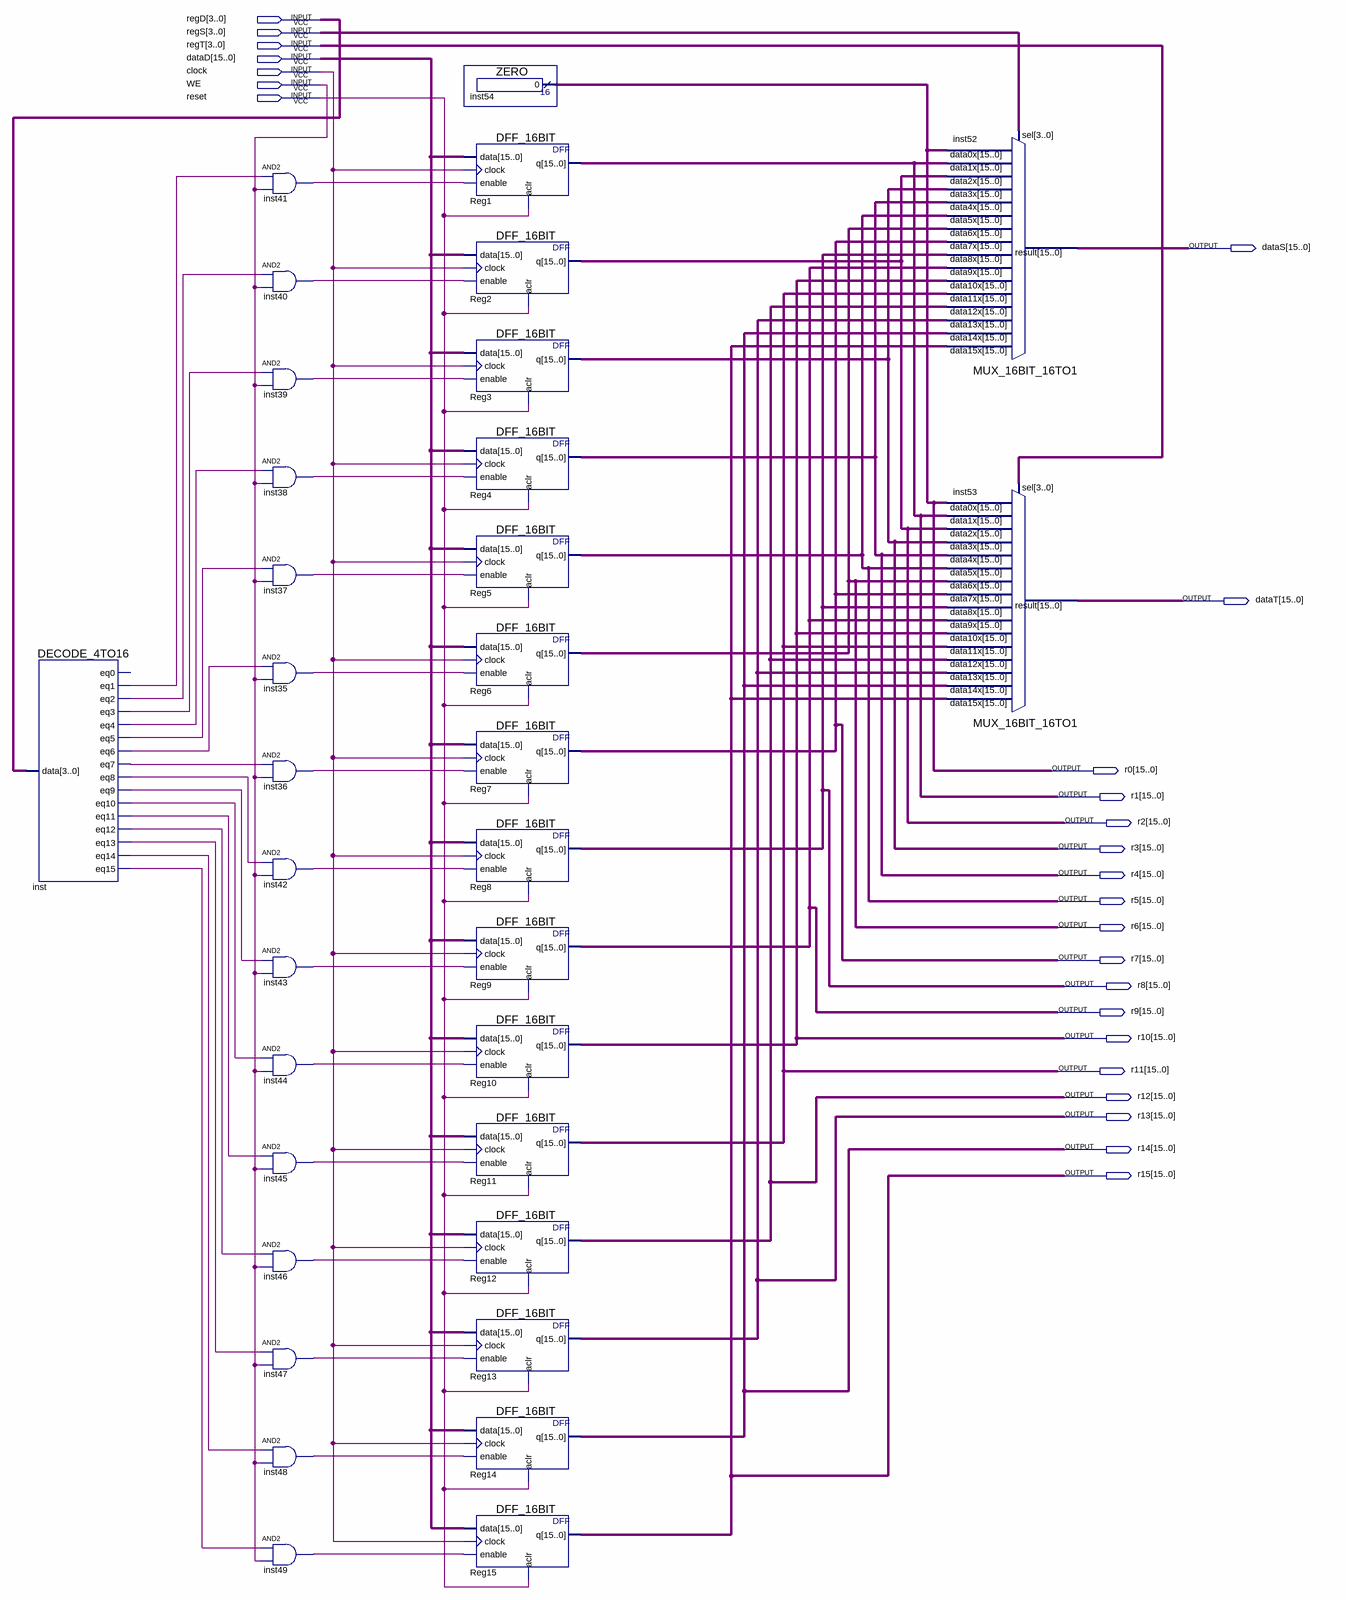
[diagram p0: schematic sheet]
// Quartus schematic regfile.bdf as structural Verilog: 34 symbols, 25 pins
module regfile (
  input  [3:0] regD,
  input  [3:0] regS,
  input  [3:0] regT,
  input  [15:0] dataD,
  input  clock,
  input  WE,
  input  reset,
  output [15:0] dataS,
  output [15:0] dataT,
  output [15:0] r0,
  output [15:0] r1,
  output [15:0] r2,
  output [15:0] r3,
  output [15:0] r4,
  output [15:0] r5,
  output [15:0] r6,
  output [15:0] r7,
  output [15:0] r8,
  output [15:0] r9,
  output [15:0] r10,
  output [15:0] r11,
  output [15:0] r12,
  output [15:0] r13,
  output [15:0] r14,
  output [15:0] r15
);

  wire inst35_out, inst36_out, inst37_out, inst38_out, inst39_out, inst40_out, inst41_out, inst42_out,
       inst43_out, inst44_out, inst45_out, inst46_out, inst47_out, inst48_out, inst49_out, inst_eq1,
       inst_eq2, inst_eq3, inst_eq4, inst_eq5, inst_eq6, inst_eq7, inst_eq8, inst_eq9, inst_eq10, inst_eq11,
       inst_eq12, inst_eq13, inst_eq14, inst_eq15;

  DECODE_4TO16 inst (
    .data(regD), .eq1(inst_eq1), .eq2(inst_eq2), .eq3(inst_eq3), .eq4(inst_eq4), .eq5(inst_eq5),
    .eq6(inst_eq6), .eq7(inst_eq7), .eq8(inst_eq8), .eq9(inst_eq9), .eq10(inst_eq10), .eq11(inst_eq11),
    .eq12(inst_eq12), .eq13(inst_eq13), .eq14(inst_eq14), .eq15(inst_eq15));  // open: eq0
  and inst41 (inst41_out, inst_eq1, WE);
  and inst40 (inst40_out, inst_eq2, WE);
  and inst39 (inst39_out, inst_eq3, WE);
  and inst38 (inst38_out, inst_eq4, WE);
  and inst37 (inst37_out, inst_eq5, WE);
  and inst35 (inst35_out, inst_eq6, WE);
  and inst36 (inst36_out, inst_eq7, WE);
  and inst42 (inst42_out, inst_eq8, WE);
  and inst43 (inst43_out, inst_eq9, WE);
  and inst44 (inst44_out, inst_eq10, WE);
  and inst45 (inst45_out, inst_eq11, WE);
  and inst46 (inst46_out, inst_eq12, WE);
  and inst47 (inst47_out, inst_eq13, WE);
  and inst48 (inst48_out, inst_eq14, WE);
  and inst49 (inst49_out, inst_eq15, WE);
  ZERO inst54 (.result(r0));
  DFF_16BIT Reg1 (.data(dataD), .clock(clock), .enable(inst41_out), .aclr(reset), .q(r1));
  DFF_16BIT Reg2 (.data(dataD), .clock(clock), .enable(inst40_out), .aclr(reset), .q(r2));
  DFF_16BIT Reg3 (.data(dataD), .clock(clock), .enable(inst39_out), .aclr(reset), .q(r3));
  DFF_16BIT Reg4 (.data(dataD), .clock(clock), .enable(inst38_out), .aclr(reset), .q(r4));
  DFF_16BIT Reg5 (.data(dataD), .clock(clock), .enable(inst37_out), .aclr(reset), .q(r5));
  DFF_16BIT Reg6 (.data(dataD), .clock(clock), .enable(inst35_out), .aclr(reset), .q(r6));
  DFF_16BIT Reg7 (.data(dataD), .clock(clock), .enable(inst36_out), .aclr(reset), .q(r7));
  DFF_16BIT Reg8 (.data(dataD), .clock(clock), .enable(inst42_out), .aclr(reset), .q(r8));
  DFF_16BIT Reg9 (.data(dataD), .clock(clock), .enable(inst43_out), .aclr(reset), .q(r9));
  DFF_16BIT Reg10 (.data(dataD), .clock(clock), .enable(inst44_out), .aclr(reset), .q(r10));
  DFF_16BIT Reg11 (.data(dataD), .clock(clock), .enable(inst45_out), .aclr(reset), .q(r11));
  DFF_16BIT Reg12 (.data(dataD), .clock(clock), .enable(inst46_out), .aclr(reset), .q(r12));
  DFF_16BIT Reg13 (.data(dataD), .clock(clock), .enable(inst47_out), .aclr(reset), .q(r13));
  DFF_16BIT Reg14 (.data(dataD), .clock(clock), .enable(inst48_out), .aclr(reset), .q(r14));
  DFF_16BIT Reg15 (.data(dataD), .clock(clock), .enable(inst49_out), .aclr(reset), .q(r15));
  MUX_16BIT_16TO1 inst52 (
    .data15x(r15), .data14x(r14), .data13x(r13), .data12x(r12), .data11x(r11), .data10x(r10), .data9x(r9),
    .data8x(r8), .data7x(r7), .data6x(r6), .data5x(r5), .data4x(r4), .data3x(r3), .data2x(r2), .data1x(r1),
    .data0x(r0), .sel(regS), .result(dataS));
  MUX_16BIT_16TO1 inst53 (
    .data15x(r15), .data14x(r14), .data13x(r13), .data12x(r12), .data11x(r11), .data10x(r10), .data9x(r9),
    .data8x(r8), .data7x(r7), .data6x(r6), .data5x(r5), .data4x(r4), .data3x(r3), .data2x(r2), .data1x(r1),
    .data0x(r0), .sel(regT), .result(dataT));
endmodule
